# EAGLE schematic opamp (EAGLE 7.7.0)
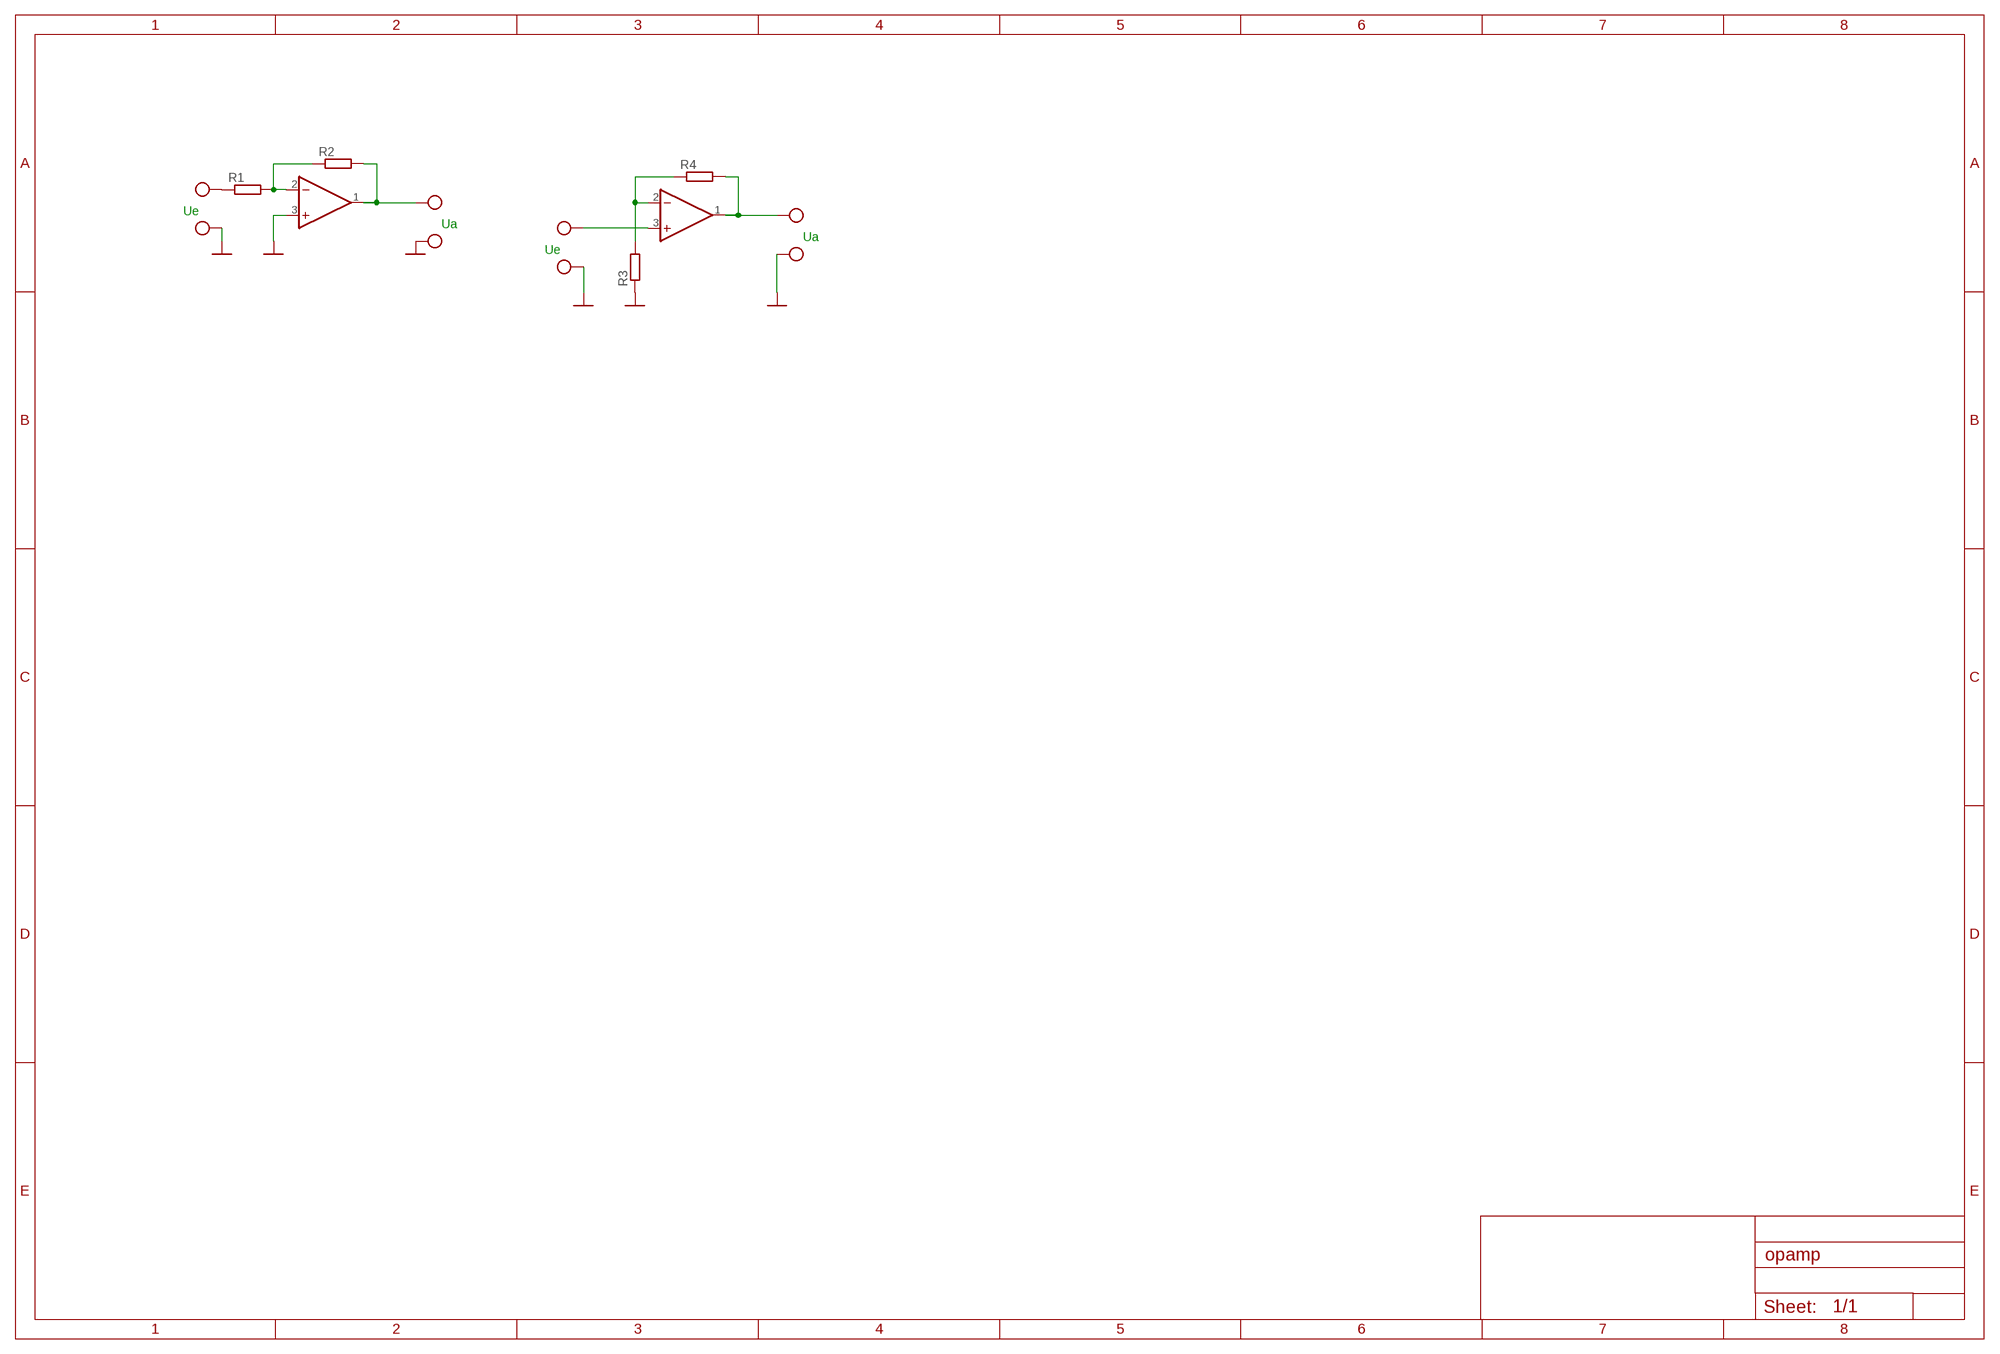
[diagram p0: schematic, sheet 1]

## Parts
IC1  LM1458N  [DIL08]
IC2  LM1458N  [DIL08]
R1  R-EU_0204/2V  [0204V]
R2  R-EU_0204/2V  [0204V]
R3  R-EU_0204/2V  [0204V]
R4  R-EU_0204/2V  [0204V]

## Nets
GND: IC1.3(A:+IN) R3.1 ; supply symbol labelled VEE
N$1: IC1.2(A:-IN) R1.2 R2.1
N$3: IC2.2(A:-IN) R3.2 R4.1
VEE: IC1.1(A:OUT) IC2.1(A:OUT) IC2.3(A:+IN) R1.1 R2.2 R4.2
Unconnected: IC1.5(B:+IN) IC1.6(B:-IN) IC1.7(B:OUT) IC2.5(B:+IN) IC2.6(B:-IN) IC2.7(B:OUT)

## Notes on the sheet
- Ue
- Ua
- Ua
- Ue

## Power pins joined to a net without a drawn wire
V+: IC1.8(P:V+) IC2.8(P:V+)
V-: IC1.4(P:V-) IC2.4(P:V-)

## Library data of the parts
IC1 IC2 = linear:*1458: OP AMP
R1-R4 = rcl:R-EU_: RESISTOR, European symbol